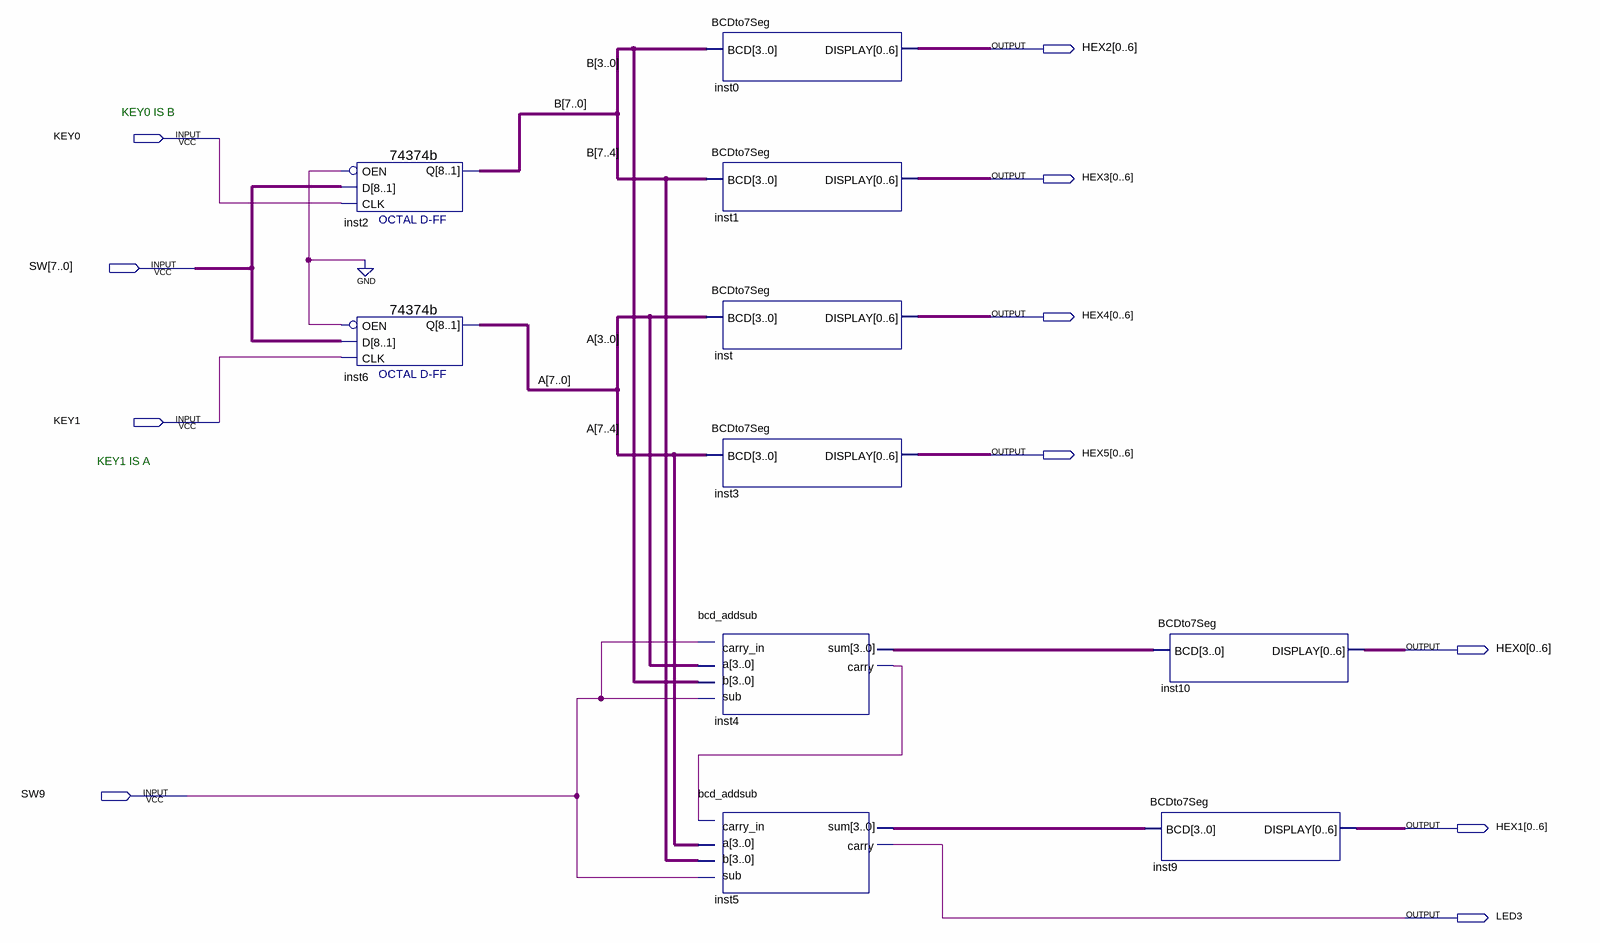
[diagram p0: schematic sheet]
// Quartus schematic Final.bdf as structural Verilog: 10 symbols, 11 pins
module Final (
  input  KEY0,
  input  [7:0] SW,
  input  KEY1,
  input  SW9,
  output [0:6] HEX2,
  output [0:6] HEX3,
  output [0:6] HEX4,
  output [0:6] HEX5,
  output [0:6] HEX0,
  output [0:6] HEX1,
  output LED3
);

  wire inst4_carry;
  wire [3:0] inst4_sum, inst5_sum;
  wire [7:0] A, B;

  \74374b  inst2 (.D(SW), .OEN(1'b0), .CLK(KEY0), .Q(B));
  \74374b  inst6 (.D(SW), .OEN(1'b0), .CLK(KEY1), .Q(A));
  BCDto7Seg inst0 (.BCD(B[3:0]), .DISPLAY(HEX2));
  BCDto7Seg inst1 (.BCD(B[7:4]), .DISPLAY(HEX3));
  BCDto7Seg inst (.BCD(A[3:0]), .DISPLAY(HEX4));
  BCDto7Seg inst3 (.BCD(A[7:4]), .DISPLAY(HEX5));
  bcd_addsub inst4 (.a(A[3:0]), .b(B[3:0]), .sub(SW9), .carry_in(SW9), .sum(inst4_sum), .carry(inst4_carry));
  bcd_addsub inst5 (.a(A[7:4]), .b(B[7:4]), .sub(SW9), .carry_in(inst4_carry), .sum(inst5_sum), .carry(LED3));
  BCDto7Seg inst10 (.BCD(inst4_sum), .DISPLAY(HEX0));
  BCDto7Seg inst9 (.BCD(inst5_sum), .DISPLAY(HEX1));

  // Notes on the sheet:
  //   KEY0 IS B
  //   KEY1 IS A
endmodule
